# Altium schematic sheet IN-14 VALVE ANODE DRIVER.SchDoc
size A4; SheetNumber: 6; SheetTotal: 9
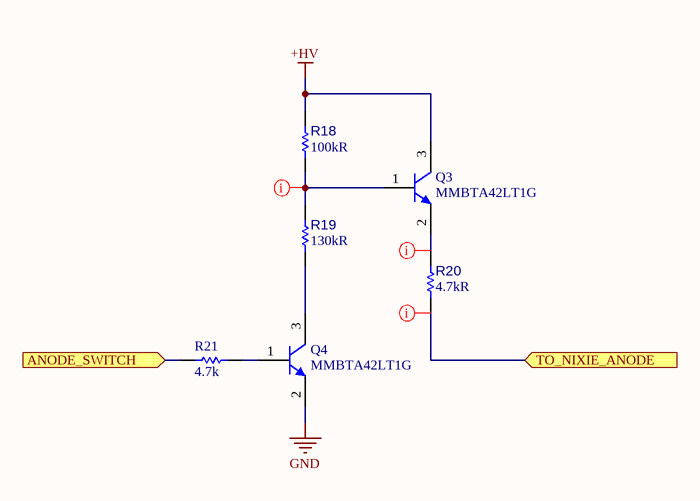
[diagram p0: IN-14 VALVE ANODE DRIVER.SchDoc]

## Parts
?  (no value)
Q3  MMBTA42LT1G  [ONSC-SOT-23-3-318-08_V]
Q4  MMBTA42LT1G  [ONSC-SOT-23-3-318-08_V]
R18  value 100kR  [RESC3126X65X50NL10T20]  (hidden comment: CRGCQ1210F100K)
R19  value 130kR  [RESC3126X65X50NL10T20]  (hidden comment: ERJP14F1303U)
R20  value 4.7kR  [RESC3126X65X50NL10T20]  (hidden comment: CRGCQ1210F4K7)
R21  value 4.7k  [RESC1608X55X25NL10T15]  (hidden comment: Resistor 4k7 +/-1% 0603 100 mW)

## Ports
ANODE_SWITCH (in), TO_NIXIE_ANODE (in)

## Nets
+HV: Q3.3(C) R18.2
GND: Q4.2(E)
ANODE_SWITCH: R21.1 ; port ANODE_SWITCH
TO_NIXIE_ANODE: R20.1 ; port TO_NIXIE_ANODE
NetQ3_1: Q3.1(B) R18.1 R19.2
NetQ3_2: Q3.2(E) R20.2
NetQ4_1: Q4.1(B) R21.2
NetQ4_3: Q4.3(C) R19.1

## Layout directives
net class HIGH VOLTAGE: NetQ3_1, NetQ3_2, TO_NIXIE_ANODE

## Notes on the sheet
- Project:
- Designer:
- Sheet
- of
- Filename:

## Library data of the parts
? = CMP-00003-4: The KETS Schematic Sheet Title Block
Q3 Q4 = CMP-013-00062-1: Bipolar (BJT) Single Transistor, General Purpose, NPN, 300 V, 500 mA, 225 mW, SOT-23, Surface Mount; Manufacturer Lifecycle Status: ACTIVE; Frequency: 50MHz; Max Collector Current: 500mA; Collector Emitter Breakdown Voltage: 300V; Emitter Base Voltage (VEBO): 6V; Collector Emitter Saturation Voltage: 500mV; Number of Elements: 1; Max Power Dissipation: 300mW; hFE Min: 40; Clock Frequency: 50MHz; Element Configuration: Single; Packaging: Tape and Reel; Lead Free: Lead Free; RoHS: Compliant; Number of Terminals: 3; Lifecycle Status: Production; Current Rating: 500mA; Polarity: NPN; Width: 1.397mm; Case/Package: SOT-23-3; Max Operating Temperature: 150°C; China RoHS: Compliant; Height: 1.016mm; Weight: 4.535924g; Gain Bandwidth Product: 50MHz; Contact Plating: Tin; Schedule B: 8541210080, 8541210080; Pins: 3; Transition Frequency: 50MHz; Voltage Rating (DC): 300V; REACH SVHC: Yes; Collector Emitter Voltage (VCEO): 300V; Min Operating Temperature: -55°C; Collector Base Voltage (VCBO): 300V; Length: 3.0226mm; Max Breakdown Voltage: 300V; Radiation Hardening: No
R18 = CMP-00394-2: Res Thick Film 1210 100K Ohm 1% 0.5W(1/2W) ±100ppm/C Pad SMD Automotive T/R; Manufacturer Lifecycle Status: ACTIVE; Working Voltage: 200V; Power: 500mW; Temperature Coefficient: 100ppm/°C; Ambient Temperature Range High: 70°C; Number of Terminals: 2; Height: 550µm; Operating Supply Voltage: 200V; Max Operating Temperature: 155°C; RoHS: Compliant; Lifecycle Status: Production; Mounting Technology: Surface Mount; Composition: Thick Film; Min Operating Temperature: -55°C; Case/Package: 1210; China RoHS: Non-Compliant; Power Dissipation: 500mW; REACH SVHC: Yes; Width: 2.6mm; Voltage Rating (DC): 200V; Power Rating: 500mW; Schedule B: 8533210025, 8533210025; Tolerance: 1%; Pins: 2; Voltage Rating: 200V; Packaging: Cut Tape
R19 = CMP-00392-1: Res Thick Film 1210 130K Ohm 1% 0.5W ±100ppm/°C Molded SMD Embossed Carrier T/R; Manufacturer Lifecycle Status: ACTIVE; Part Series: Anti-Surge High Power Thick Film Chip Resistors; Power Rating: 500mW; Working Voltage: 200V; Min Operating Temperature: -55°C; Case Code (Imperial): 1210; REACH SVHC: Yes; Number of Terminals: 2; Case/Package: 1210; Packaging: Cut Tape; Width: 2.5mm; Composition: Thick Film; Tolerance: 1%; Power: 500mW; Lifecycle Status: Production; Voltage Rating: 200V; Power Dissipation: 500mW; Mounting Technology: Surface Mount; Height: 600µm; Max Operating Temperature: 155°C; RoHS: Compliant; Case Code (Metric): 3225; Length: 3.2mm; Depth: 2.5mm; Voltage Rating (DC): 200V; Termination: Flat; Pins: 2; Temperature Coefficient: 100ppm/°C; Contact Plating: Tin
R20 = CMP-00386-2: Res Thick Film 1210 4.7K Ohm 1% 0.5W(1/2W) ±100ppm/C Pad SMD T/R Automotive AEC-Q200; Manufacturer Lifecycle Status: ACTIVE; Voltage Rating (DC): 200V; Temperature Coefficient: 100ppm/°C; Power Dissipation: 500mW; China RoHS: Non-Compliant; Pins: 2; Width: 2.6mm; REACH SVHC: Yes; Height: 550µm; RoHS: Compliant; Mounting Technology: Surface Mount; Tolerance: 1%; Case/Package: 1210; Schedule B: 8533210025, 8533210025; Ambient Temperature Range High: 70°C; Min Operating Temperature: -55°C; Lifecycle Status: Production; Operating Supply Voltage: 200V; Working Voltage: 200V; Max Operating Temperature: 155°C; Composition: Thick Film; Power: 500mW; Power Rating: 500mW; Voltage Rating: 200V; Packaging: Cut Tape; Number of Terminals: 2
R21 = CMP-009-00031-13: Chip Resistor, 4.7 KOhm, +/- 1%, 0.1 W, -55 to 155 degC, 0603 (1608 Metric); Power: 100mW; RoHS Compliant: True; Min Operating Temperature: -55°C; Tolerance: 1%; Mounting Technology: SM; Max Operating Temperature: 155°C; Pins: 2; Case/Package: 0603